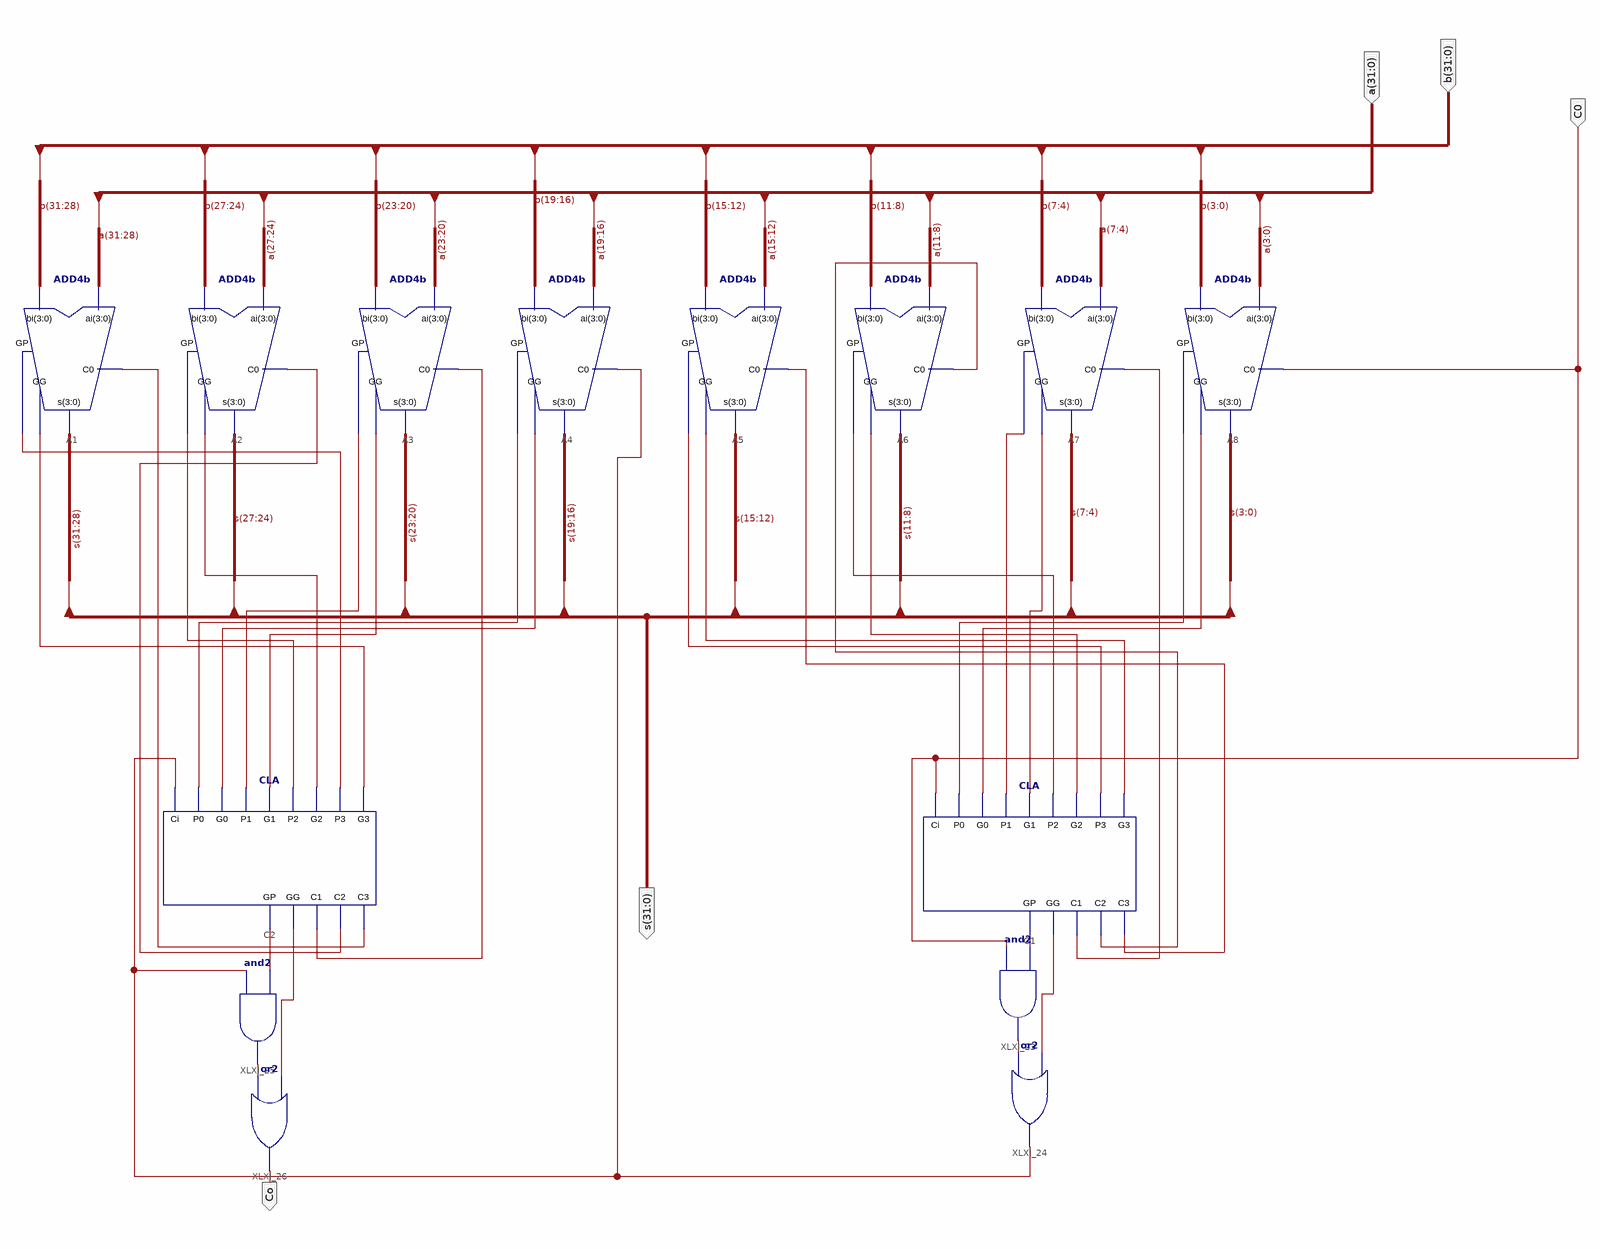
[diagram p0: schematic sheet 1]
// Xilinx ISE schematic ADC32.sch (kintex7) as structural Verilog: 14 symbols, 5 ports
module ADC32 (
  input  [31:0] b,
  input  [31:0] a,
  input  C0,
  output [31:0] s,
  output Co
);

  wire XLXN_36, XLXN_37, XLXN_38, XLXN_39, XLXN_40, XLXN_41, XLXN_42, XLXN_43, XLXN_44, XLXN_45, XLXN_46,
       XLXN_47, XLXN_50, XLXN_51, XLXN_54, XLXN_55, XLXN_56, XLXN_57, XLXN_58, XLXN_59, XLXN_60, XLXN_61,
       XLXN_62, XLXN_63, XLXN_64, XLXN_65, XLXN_66, XLXN_67, XLXN_68;

  ADD4b A1 (.ai(a[31:28]), .C0(XLXN_65), .s(s[31:28]), .GP(XLXN_62), .GG(XLXN_61), .bi(b[31:28]));
  ADD4b A2 (.ai(a[27:24]), .C0(XLXN_64), .s(s[27:24]), .GP(XLXN_60), .GG(XLXN_59), .bi(b[27:24]));
  ADD4b A3 (.ai(a[23:20]), .C0(XLXN_63), .s(s[23:20]), .GP(XLXN_57), .GG(XLXN_58), .bi(b[23:20]));
  ADD4b A4 (.ai(a[19:16]), .C0(XLXN_54), .s(s[19:16]), .GP(XLXN_55), .GG(XLXN_56), .bi(b[19:16]));
  ADD4b A5 (.ai(a[15:12]), .C0(XLXN_46), .s(s[15:12]), .GP(XLXN_43), .GG(XLXN_42), .bi(b[15:12]));
  ADD4b A6 (.ai(a[11:8]), .C0(XLXN_45), .s(s[11:8]), .GP(XLXN_41), .GG(XLXN_40), .bi(b[11:8]));
  ADD4b A7 (.ai(a[7:4]), .C0(XLXN_44), .s(s[7:4]), .GP(XLXN_39), .GG(XLXN_38), .bi(b[7:4]));
  ADD4b A8 (.ai(a[3:0]), .C0(C0), .s(s[3:0]), .GP(XLXN_36), .GG(XLXN_37), .bi(b[3:0]));
  CLA C2 (
    .C1(XLXN_63), .C2(XLXN_64), .C3(XLXN_65), .Ci(XLXN_54), .G0(XLXN_56), .G1(XLXN_58), .G2(XLXN_59),
    .G3(XLXN_61), .GG(XLXN_68), .GP(XLXN_66), .P0(XLXN_55), .P1(XLXN_57), .P2(XLXN_60), .P3(XLXN_62));
  CLA C1 (
    .C1(XLXN_44), .C2(XLXN_45), .C3(XLXN_46), .Ci(C0), .G0(XLXN_37), .G1(XLXN_38), .G2(XLXN_40),
    .G3(XLXN_42), .GG(XLXN_51), .GP(XLXN_47), .P0(XLXN_36), .P1(XLXN_39), .P2(XLXN_41), .P3(XLXN_43));
  and XLXI_23 (XLXN_50, C0, XLXN_47);
  or XLXI_24 (XLXN_54, XLXN_50, XLXN_51);
  and XLXI_25 (XLXN_67, XLXN_54, XLXN_66);
  or XLXI_26 (Co, XLXN_67, XLXN_68);
endmodule
